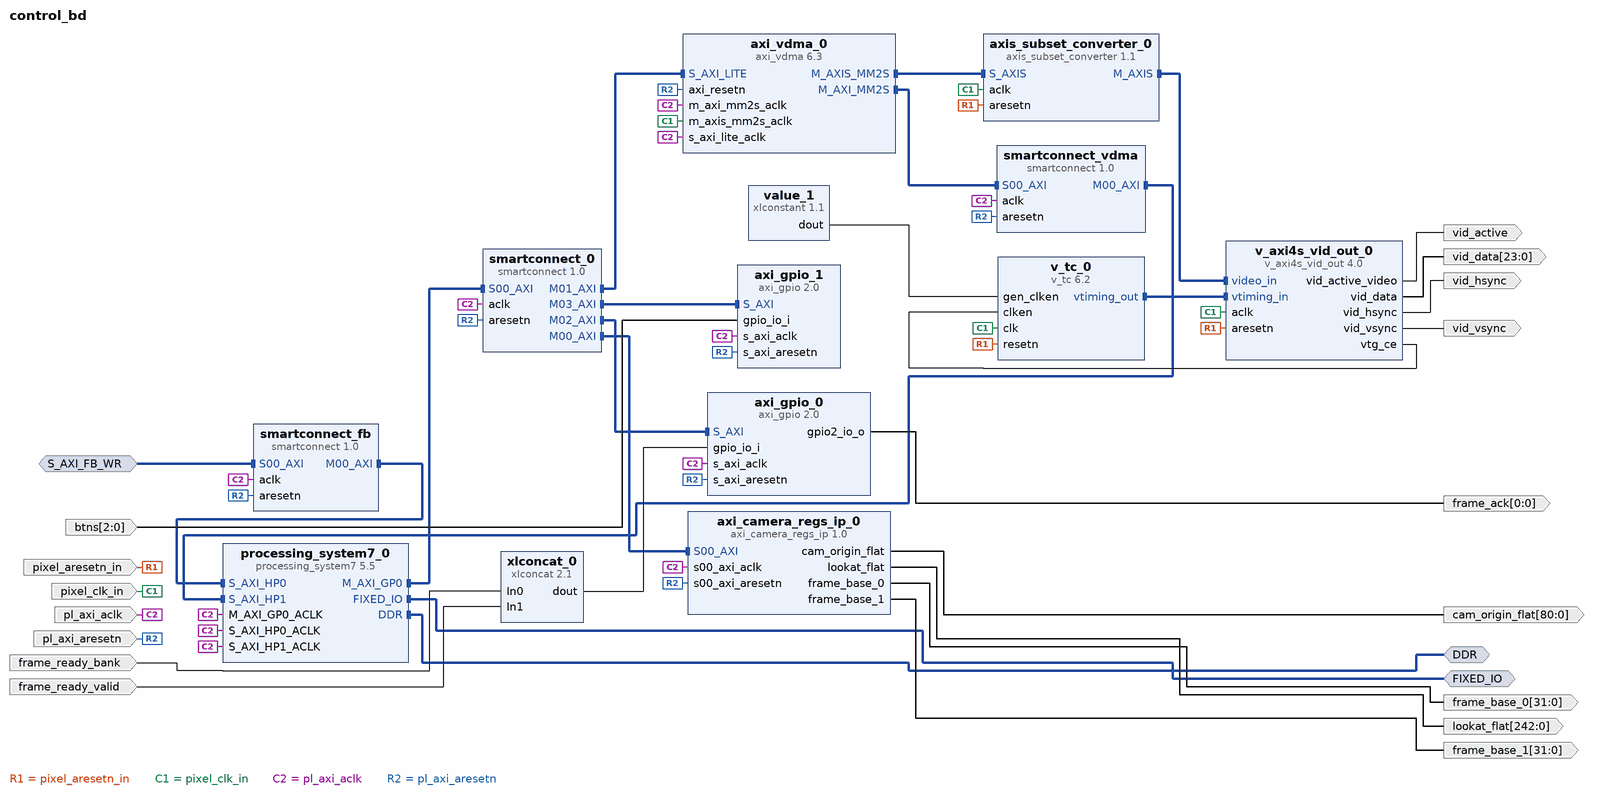
[diagram p0: block diagram of the top level]
# Vivado block design control_bd, xc7z020clg400-1, Vivado 2020.2
create_bd_design control_bd

create_bd_intf_port -mode Master -vlnv xilinx.com:interface:ddrx_rtl:1.0 DDR
create_bd_intf_port -mode Master -vlnv xilinx.com:display_processing_system7:fixedio_rtl:1.0 FIXED_IO
create_bd_intf_port -mode Slave -vlnv xilinx.com:interface:aximm_rtl:1.0 S_AXI_FB_WR
set_property -dict [list \
  CONFIG.ADDR_WIDTH 32 \
  CONFIG.ARUSER_WIDTH 0 \
  CONFIG.AWUSER_WIDTH 0 \
  CONFIG.BUSER_WIDTH 0 \
  CONFIG.DATA_WIDTH 64 \
  CONFIG.FREQ_HZ 125000000 \
  CONFIG.HAS_BRESP 1 \
  CONFIG.HAS_BURST 1 \
  CONFIG.HAS_CACHE 1 \
  CONFIG.HAS_LOCK 1 \
  CONFIG.HAS_PROT 1 \
  CONFIG.HAS_QOS 1 \
  CONFIG.HAS_REGION 1 \
  CONFIG.HAS_RRESP 1 \
  CONFIG.HAS_WSTRB 1 \
  CONFIG.ID_WIDTH 0 \
  CONFIG.MAX_BURST_LENGTH 256 \
  CONFIG.NUM_READ_OUTSTANDING 1 \
  CONFIG.NUM_READ_THREADS 1 \
  CONFIG.NUM_WRITE_OUTSTANDING 1 \
  CONFIG.NUM_WRITE_THREADS 1 \
  CONFIG.PROTOCOL AXI4 \
  CONFIG.READ_WRITE_MODE READ_WRITE \
  CONFIG.RUSER_BITS_PER_BYTE 0 \
  CONFIG.RUSER_WIDTH 0 \
  CONFIG.SUPPORTS_NARROW_BURST 1 \
  CONFIG.WUSER_BITS_PER_BYTE 0 \
  CONFIG.WUSER_WIDTH 0 \
] [get_bd_intf_ports S_AXI_FB_WR]
create_bd_port -dir O -from 242 -to 0 lookat_flat
create_bd_port -dir O -from 80 -to 0 cam_origin_flat
create_bd_port -dir O -from 31 -to 0 frame_base_0
create_bd_port -dir O -from 31 -to 0 frame_base_1
create_bd_port -dir I -type rst pl_axi_aresetn
create_bd_port -dir I -type rst pixel_aresetn_in
set_property -dict {CONFIG.POLARITY ACTIVE_LOW} [get_bd_ports pixel_aresetn_in]
create_bd_port -dir O -type data vid_hsync
create_bd_port -dir O -type data vid_vsync
create_bd_port -dir O -type data vid_active
create_bd_port -dir O -from 23 -to 0 -type data vid_data
create_bd_port -dir I -type data frame_ready_valid
create_bd_port -dir I -type data frame_ready_bank
create_bd_port -dir O -from 0 -to 0 -type data frame_ack
create_bd_port -dir I -type clk pl_axi_aclk
set_property -dict {CONFIG.FREQ_HZ 125000000} [get_bd_ports pl_axi_aclk]
create_bd_port -dir I -type clk pixel_clk_in
set_property -dict {CONFIG.FREQ_HZ 51206400} [get_bd_ports pixel_clk_in]
create_bd_port -dir I -from 2 -to 0 btns

create_bd_cell -type ip -vlnv xilinx.com:ip:processing_system7:5.5 processing_system7_0
set_property -dict {CONFIG.PCW_USE_S_AXI_HP0 1 CONFIG.PCW_USE_S_AXI_HP1 1} [get_bd_cells processing_system7_0]
# 1 more settings of processing_system7_0 are not shown: defaults, MIO pin electricals, DDR timing, and values the tool derives
create_bd_cell -type ip -vlnv xilinx.com:user:axi_camera_regs_ip:1.0 axi_camera_regs_ip_0
create_bd_cell -type ip -vlnv xilinx.com:ip:smartconnect:1.0 smartconnect_0
set_property -dict {CONFIG.NUM_MI 4} [get_bd_cells smartconnect_0]
create_bd_cell -type ip -vlnv xilinx.com:ip:axi_vdma:6.3 axi_vdma_0
set_property -dict {CONFIG.c_include_s2mm 0 CONFIG.c_num_fstores 2} [get_bd_cells axi_vdma_0]
create_bd_cell -type ip -vlnv xilinx.com:ip:v_tc:6.2 v_tc_0
set_property -dict [list \
  CONFIG.GEN_F0_VBLANK_HEND 512 \
  CONFIG.GEN_F0_VBLANK_HSTART 512 \
  CONFIG.GEN_F0_VFRAME_SIZE 635 \
  CONFIG.GEN_F0_VSYNC_HEND 512 \
  CONFIG.GEN_F0_VSYNC_HSTART 512 \
  CONFIG.GEN_F0_VSYNC_VEND 615 \
  CONFIG.GEN_F0_VSYNC_VSTART 612 \
  CONFIG.GEN_HACTIVE_SIZE 1024 \
  CONFIG.GEN_HFRAME_SIZE 1344 \
  CONFIG.GEN_HSYNC_END 1224 \
  CONFIG.GEN_HSYNC_START 1104 \
  CONFIG.GEN_VACTIVE_SIZE 600 \
  CONFIG.HAS_AXI4_LITE false \
  CONFIG.VIDEO_MODE Custom \
  CONFIG.enable_detection false \
] [get_bd_cells v_tc_0]
create_bd_cell -type ip -vlnv xilinx.com:ip:v_axi4s_vid_out:4.0 v_axi4s_vid_out_0
create_bd_cell -type ip -vlnv xilinx.com:ip:axi_gpio:2.0 axi_gpio_0
set_property -dict [list \
  CONFIG.C_ALL_INPUTS 1 \
  CONFIG.C_ALL_OUTPUTS_2 1 \
  CONFIG.C_GPIO2_WIDTH 1 \
  CONFIG.C_GPIO_WIDTH 2 \
  CONFIG.C_IS_DUAL 1 \
] [get_bd_cells axi_gpio_0]
create_bd_cell -type ip -vlnv xilinx.com:ip:axi_gpio:2.0 axi_gpio_1
set_property -dict {CONFIG.C_ALL_INPUTS 1 CONFIG.C_GPIO_WIDTH 3} [get_bd_cells axi_gpio_1]
create_bd_cell -type ip -vlnv xilinx.com:ip:smartconnect:1.0 smartconnect_fb
set_property -dict {CONFIG.NUM_SI 1} [get_bd_cells smartconnect_fb]
create_bd_cell -type ip -vlnv xilinx.com:ip:xlconstant:1.1 value_1
create_bd_cell -type ip -vlnv xilinx.com:ip:smartconnect:1.0 smartconnect_vdma
set_property -dict {CONFIG.NUM_SI 1} [get_bd_cells smartconnect_vdma]
create_bd_cell -type ip -vlnv xilinx.com:ip:xlconcat:2.1 xlconcat_0
create_bd_cell -type ip -vlnv xilinx.com:ip:axis_subset_converter:1.1 axis_subset_converter_0
set_property -dict [list \
  CONFIG.M_HAS_TKEEP 1 \
  CONFIG.M_HAS_TLAST 1 \
  CONFIG.M_HAS_TREADY 1 \
  CONFIG.M_HAS_TSTRB 0 \
  CONFIG.M_TDATA_NUM_BYTES 3 \
  CONFIG.M_TDEST_WIDTH 0 \
  CONFIG.M_TID_WIDTH 0 \
  CONFIG.M_TUSER_WIDTH 1 \
  CONFIG.S_HAS_TKEEP 1 \
  CONFIG.S_HAS_TLAST 1 \
  CONFIG.S_HAS_TREADY 1 \
  CONFIG.S_HAS_TSTRB 0 \
  CONFIG.S_TDATA_NUM_BYTES 4 \
  CONFIG.S_TDEST_WIDTH 0 \
  CONFIG.S_TID_WIDTH 0 \
  CONFIG.S_TUSER_WIDTH 1 \
  CONFIG.TDATA_REMAP {tdata[23:0]} \
] [get_bd_cells axis_subset_converter_0]

# ---- connections ----

connect_bd_intf_net [get_bd_intf_ports FIXED_IO] [get_bd_intf_pins processing_system7_0/FIXED_IO]
connect_bd_intf_net [get_bd_intf_pins axi_vdma_0/M_AXIS_MM2S] [get_bd_intf_pins axis_subset_converter_0/S_AXIS]
connect_bd_intf_net [get_bd_intf_pins smartconnect_0/S00_AXI] [get_bd_intf_pins processing_system7_0/M_AXI_GP0]
connect_bd_intf_net [get_bd_intf_pins v_tc_0/vtiming_out] [get_bd_intf_pins v_axi4s_vid_out_0/vtiming_in]
connect_bd_intf_net [get_bd_intf_pins axis_subset_converter_0/M_AXIS] [get_bd_intf_pins v_axi4s_vid_out_0/video_in]
connect_bd_intf_net [get_bd_intf_pins axi_vdma_0/M_AXI_MM2S] [get_bd_intf_pins smartconnect_vdma/S00_AXI]
connect_bd_intf_net [get_bd_intf_pins smartconnect_0/M01_AXI] [get_bd_intf_pins axi_vdma_0/S_AXI_LITE]
connect_bd_intf_net [get_bd_intf_pins smartconnect_fb/M00_AXI] [get_bd_intf_pins processing_system7_0/S_AXI_HP0]
connect_bd_intf_net [get_bd_intf_pins smartconnect_0/M02_AXI] [get_bd_intf_pins axi_gpio_0/S_AXI]
connect_bd_intf_net [get_bd_intf_ports DDR] [get_bd_intf_pins processing_system7_0/DDR]
connect_bd_intf_net [get_bd_intf_pins axi_camera_regs_ip_0/S00_AXI] [get_bd_intf_pins smartconnect_0/M00_AXI]
connect_bd_intf_net [get_bd_intf_pins smartconnect_0/M03_AXI] [get_bd_intf_pins axi_gpio_1/S_AXI]
connect_bd_intf_net [get_bd_intf_pins processing_system7_0/S_AXI_HP1] [get_bd_intf_pins smartconnect_vdma/M00_AXI]
connect_bd_intf_net [get_bd_intf_ports S_AXI_FB_WR] [get_bd_intf_pins smartconnect_fb/S00_AXI]
connect_bd_net [get_bd_pins axi_camera_regs_ip_0/cam_origin_flat] [get_bd_ports cam_origin_flat]
connect_bd_net [get_bd_pins axi_camera_regs_ip_0/lookat_flat] [get_bd_ports lookat_flat]
connect_bd_net [get_bd_pins axi_camera_regs_ip_0/frame_base_0] [get_bd_ports frame_base_0]
connect_bd_net [get_bd_pins axi_camera_regs_ip_0/frame_base_1] [get_bd_ports frame_base_1]
connect_bd_net [get_bd_pins axi_gpio_0/gpio2_io_o] [get_bd_ports frame_ack]
connect_bd_net [get_bd_ports frame_ready_bank] [get_bd_pins xlconcat_0/In0]
connect_bd_net [get_bd_ports frame_ready_valid] [get_bd_pins xlconcat_0/In1]
connect_bd_net [get_bd_ports pixel_aresetn_in] \
  [get_bd_pins v_tc_0/resetn] [get_bd_pins v_axi4s_vid_out_0/aresetn] [get_bd_pins axis_subset_converter_0/aresetn]
connect_bd_net [get_bd_ports pixel_clk_in] \
  [get_bd_pins v_tc_0/clk] [get_bd_pins v_axi4s_vid_out_0/aclk] [get_bd_pins axi_vdma_0/m_axis_mm2s_aclk] \
  [get_bd_pins axis_subset_converter_0/aclk]
connect_bd_net -net s00_axi_aclk_0_1 [get_bd_ports pl_axi_aclk] \
  [get_bd_pins axi_camera_regs_ip_0/s00_axi_aclk] [get_bd_pins smartconnect_0/aclk] \
  [get_bd_pins processing_system7_0/M_AXI_GP0_ACLK] [get_bd_pins axi_gpio_0/s_axi_aclk] [get_bd_pins axi_gpio_1/s_axi_aclk] \
  [get_bd_pins axi_vdma_0/s_axi_lite_aclk] [get_bd_pins smartconnect_fb/aclk] \
  [get_bd_pins processing_system7_0/S_AXI_HP0_ACLK] [get_bd_pins processing_system7_0/S_AXI_HP1_ACLK] \
  [get_bd_pins axi_vdma_0/m_axi_mm2s_aclk] [get_bd_pins smartconnect_vdma/aclk]
connect_bd_net -net s00_axi_aresetn_0_1 [get_bd_ports pl_axi_aresetn] \
  [get_bd_pins axi_camera_regs_ip_0/s00_axi_aresetn] [get_bd_pins smartconnect_0/aresetn] [get_bd_pins axi_vdma_0/axi_resetn] \
  [get_bd_pins axi_gpio_0/s_axi_aresetn] [get_bd_pins axi_gpio_1/s_axi_aresetn] [get_bd_pins smartconnect_fb/aresetn] \
  [get_bd_pins smartconnect_vdma/aresetn]
connect_bd_net [get_bd_pins v_axi4s_vid_out_0/vid_active_video] [get_bd_ports vid_active]
connect_bd_net [get_bd_pins v_axi4s_vid_out_0/vid_data] [get_bd_ports vid_data]
connect_bd_net [get_bd_pins v_axi4s_vid_out_0/vid_hsync] [get_bd_ports vid_hsync]
connect_bd_net [get_bd_pins v_axi4s_vid_out_0/vid_vsync] [get_bd_ports vid_vsync]
connect_bd_net [get_bd_pins v_axi4s_vid_out_0/vtg_ce] [get_bd_pins v_tc_0/clken]
connect_bd_net [get_bd_pins value_1/dout] [get_bd_pins v_tc_0/gen_clken]
connect_bd_net [get_bd_pins xlconcat_0/dout] [get_bd_pins axi_gpio_0/gpio_io_i]
connect_bd_net [get_bd_ports btns] [get_bd_pins axi_gpio_1/gpio_io_i]

# ---- address map ----
assign_bd_address -offset 0x00000000 -range 512M -target_address_space [get_bd_addr_spaces axi_vdma_0/Data_MM2S] [get_bd_addr_segs processing_system7_0/S_AXI_HP1/HP1_DDR_LOWOCM]
assign_bd_address -offset 0x41200000 -range 64K -target_address_space [get_bd_addr_spaces processing_system7_0/Data] [get_bd_addr_segs axi_gpio_0/S_AXI/Reg]
assign_bd_address -offset 0x41210000 -range 64K -target_address_space [get_bd_addr_spaces processing_system7_0/Data] [get_bd_addr_segs axi_gpio_1/S_AXI/Reg]
assign_bd_address -offset 0x43000000 -range 64K -target_address_space [get_bd_addr_spaces processing_system7_0/Data] [get_bd_addr_segs axi_vdma_0/S_AXI_LITE/Reg]
assign_bd_address -offset 0x43C00000 -range 64K -target_address_space [get_bd_addr_spaces processing_system7_0/Data] [get_bd_addr_segs axi_camera_regs_ip_0/S00_AXI/S00_AXI_reg]
assign_bd_address -offset 0x00000000 -range 512M -target_address_space [get_bd_addr_spaces S_AXI_FB_WR] [get_bd_addr_segs processing_system7_0/S_AXI_HP0/HP0_DDR_LOWOCM]

validate_bd_design
save_bd_design
